# Altium project PCB_Project1.PrjPCB
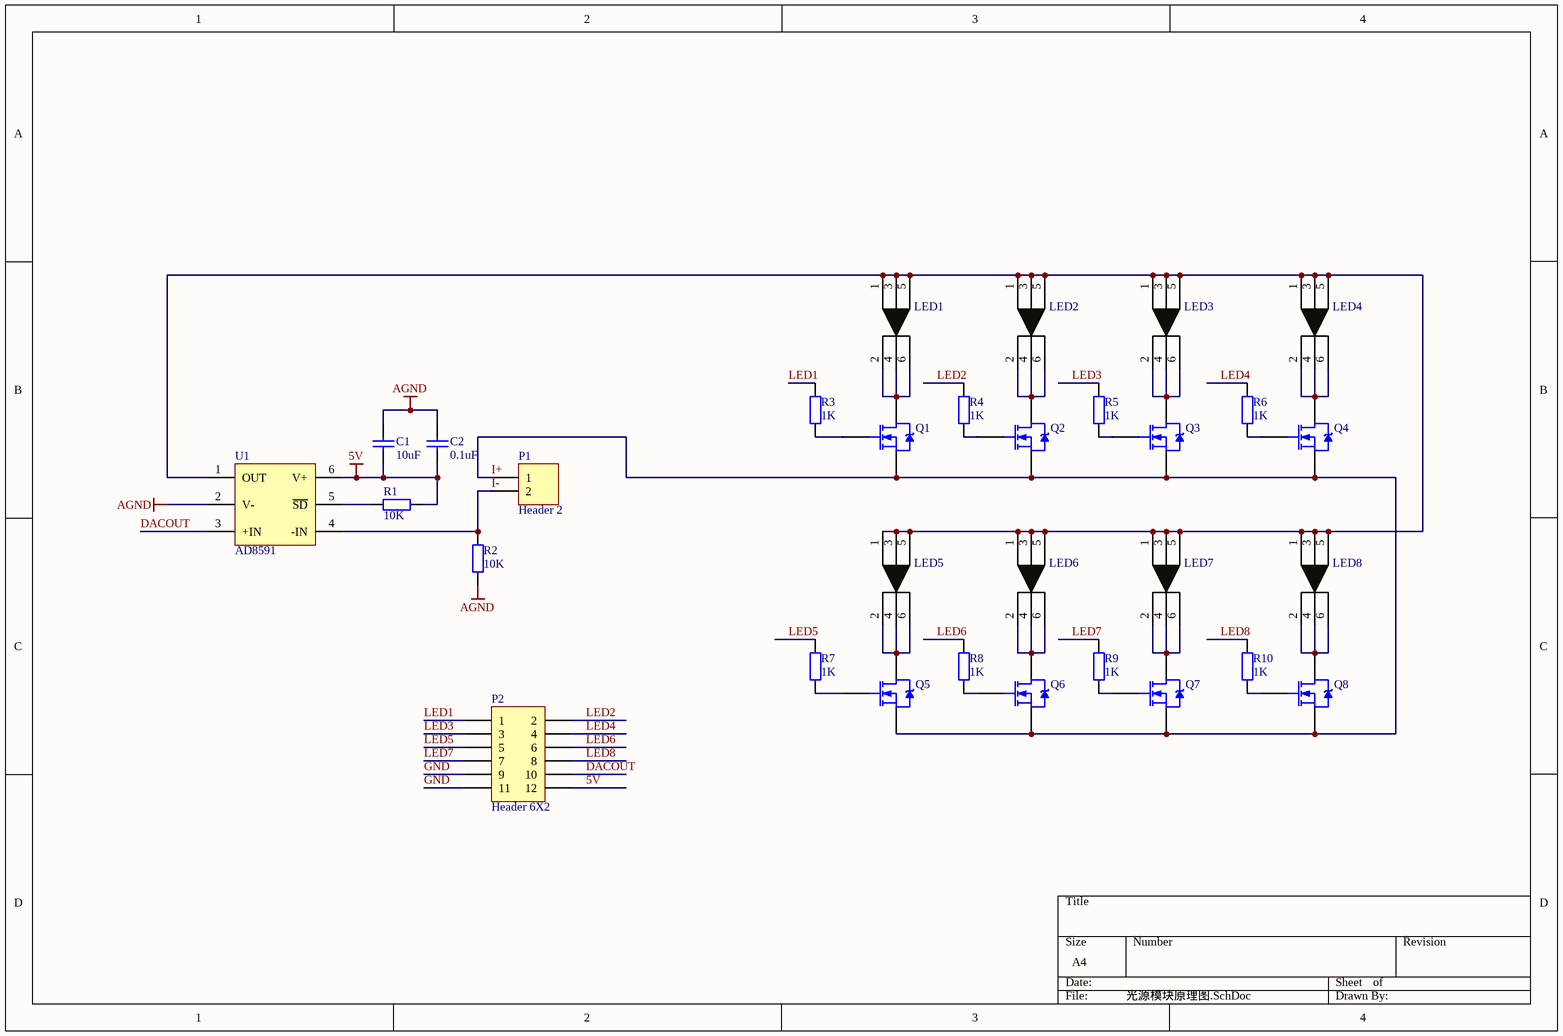
[diagram p0: 光源模块原理图.SchDoc]
1 sheet, 31 parts. Net scope: global (net labels, ports and power ports of the same name join across sheets).

## Sheet 光源模块原理图.SchDoc
size A4

### Parts
C1  value 10uF  [C 0603_M]  (hidden comment: Cap)
C2  value 0.1uF  [C 0603_M]  (hidden comment: Cap)
LED1  六脚二极管  [LED 5050]  (value not drawn)
LED2  六脚二极管  [LED 5050]  (value not drawn)
LED3  六脚二极管  [LED 5050]  (value not drawn)
LED4  六脚二极管  [LED 5050]  (value not drawn)
LED5  六脚二极管  [LED 5050]  (value not drawn)
LED6  六脚二极管  [LED 5050]  (value not drawn)
LED7  六脚二极管  [LED 5050]  (value not drawn)
LED8  六脚二极管  [LED 5050]  (value not drawn)
P1  Header 2  [HDR1X2]
P2  Header 6X2  [HDR2X6]
Q1  NMOS-2  [TO-220AB]  (value not drawn)
Q2  NMOS-2  [TO-220AB]  (value not drawn)
Q3  NMOS-2  [TO-220AB]  (value not drawn)
Q4  NMOS-2  [TO-220AB]  (value not drawn)
Q5  NMOS-2  [TO-220AB]  (value not drawn)
Q6  NMOS-2  [TO-220AB]  (value not drawn)
Q7  NMOS-2  [TO-220AB]  (value not drawn)
Q8  NMOS-2  [TO-220AB]  (value not drawn)
R1  value 10K  [R 0603_M]  (hidden comment: Res2)
R2  value 10K  [R 0603_M]  (hidden comment: Res2)
R3  value 1K  [R 1210_M]  (hidden comment: Res2)
R4  value 1K  [R 1210_M]  (hidden comment: Res2)
R5  value 1K  [R 1210_M]  (hidden comment: Res2)
R6  value 1K  [R 1210_M]  (hidden comment: Res2)
R7  value 1K  [R 1210_M]  (hidden comment: Res2)
R8  value 1K  [R 1210_M]  (hidden comment: Res2)
R9  value 1K  [R 1210_M]  (hidden comment: Res2)
R10  value 1K  [R 1210_M]  (hidden comment: Res2)
U1  AD8591  [AD8591]

### Nets
5V: C1.1 C2.1 P2.12 R1.1 U1.6(V+)
AGND: C1.2 C2.2 R2.2 U1.2(V-)
DACOUT: P2.10 U1.3(+IN)
GND: P2.9 P2.11
I+: P1.1 Q1.3(S) Q2.3(S) Q3.3(S) Q4.3(S) Q5.3(S) Q6.3(S) Q7.3(S) Q8.3(S)
I-: P1.2 R2.1 U1.4(-IN)
LED1: P2.1 R3.1
LED2: P2.2 R4.1
LED3: P2.3 R5.1
LED4: P2.4 R6.1
LED5: P2.5 R7.1
LED6: P2.6 R8.1
LED7: P2.7 R9.1
LED8: P2.8 R10.1
NetLED1_1: LED1.1 LED1.3 LED1.5 LED2.1 LED2.3 LED2.5 LED3.1 LED3.3 LED3.5 LED4.1 LED4.3 LED4.5 LED5.1 LED5.3 LED5.5 LED6.1 LED6.3 LED6.5 LED7.1 LED7.3 LED7.5 LED8.1 LED8.3 LED8.5 U1.1(OUT)
NetLED1_2: LED1.2 LED1.4 LED1.6 Q1.2(D)
NetLED2_2: LED2.2 LED2.4 LED2.6 Q2.2(D)
NetLED3_2: LED3.2 LED3.4 LED3.6 Q3.2(D)
NetLED4_2: LED4.2 LED4.4 LED4.6 Q4.2(D)
NetLED5_2: LED5.2 LED5.4 LED5.6 Q5.2(D)
NetLED6_2: LED6.2 LED6.4 LED6.6 Q6.2(D)
NetLED7_2: LED7.2 LED7.4 LED7.6 Q7.2(D)
NetLED8_2: LED8.2 LED8.4 LED8.6 Q8.2(D)
NetQ1_1: Q1.1(G) R3.2
NetQ2_1: Q2.1(G) R4.2
NetQ3_1: Q3.1(G) R5.2
NetQ4_1: Q4.1(G) R6.2
NetQ5_1: Q5.1(G) R7.2
NetQ6_1: Q6.1(G) R8.2
NetQ7_1: Q7.1(G) R9.2
NetQ8_1: Q8.1(G) R10.2
NetR1_2: R1.2 U1.5(~{SD})

### Library data of the parts
C1 C2 = Cap: Capacitor; Published: 8-Jun-2000; LatestRevisionDate: 17-Jul-2002; LatestRevisionNote: Re-released for DXP Platform.; PackageReference: RAD-0.3; Publisher: Altium Limited
P1 = Header 2: Header, 2-Pin; LatestRevisionDate: 17-Jul-2002; LatestRevisionNote: Re-released for DXP Platform.; Publisher: Altium Limited
P2 = Header 6X2: Header, 6-Pin, Dual row; LatestRevisionDate: 17-Jul-2002; LatestRevisionNote: Re-released for DXP Platform.; Publisher: Altium Limited
Q1-Q8 = NMOS-2: N-Channel Power MOSFET; Note: Pin 2 is electrically connected to pin 4.; Published: 8-Jun-2000; LatestRevisionDate: 17-Jul-2002; LatestRevisionNote: Re-released for DXP Platform.; DatasheetDocument: PD-9.814; PackageReference: TO-220AB; Publisher: Altium Limited; Code_JEDEC: TO-220-AB; ComponentLink1Description: Manufacturer Link; ComponentLink1URL: http://www.irf.com/
R1-R10 = Res2: Resistor; Published: 8-Jun-2000; LatestRevisionDate: 17-Jul-2002; LatestRevisionNote: Re-released for DXP Platform.; PackageReference: AXIAL-0.4; Publisher: Altium Limited